# EAGLE design MagSpark (EAGLE 7.1.0)
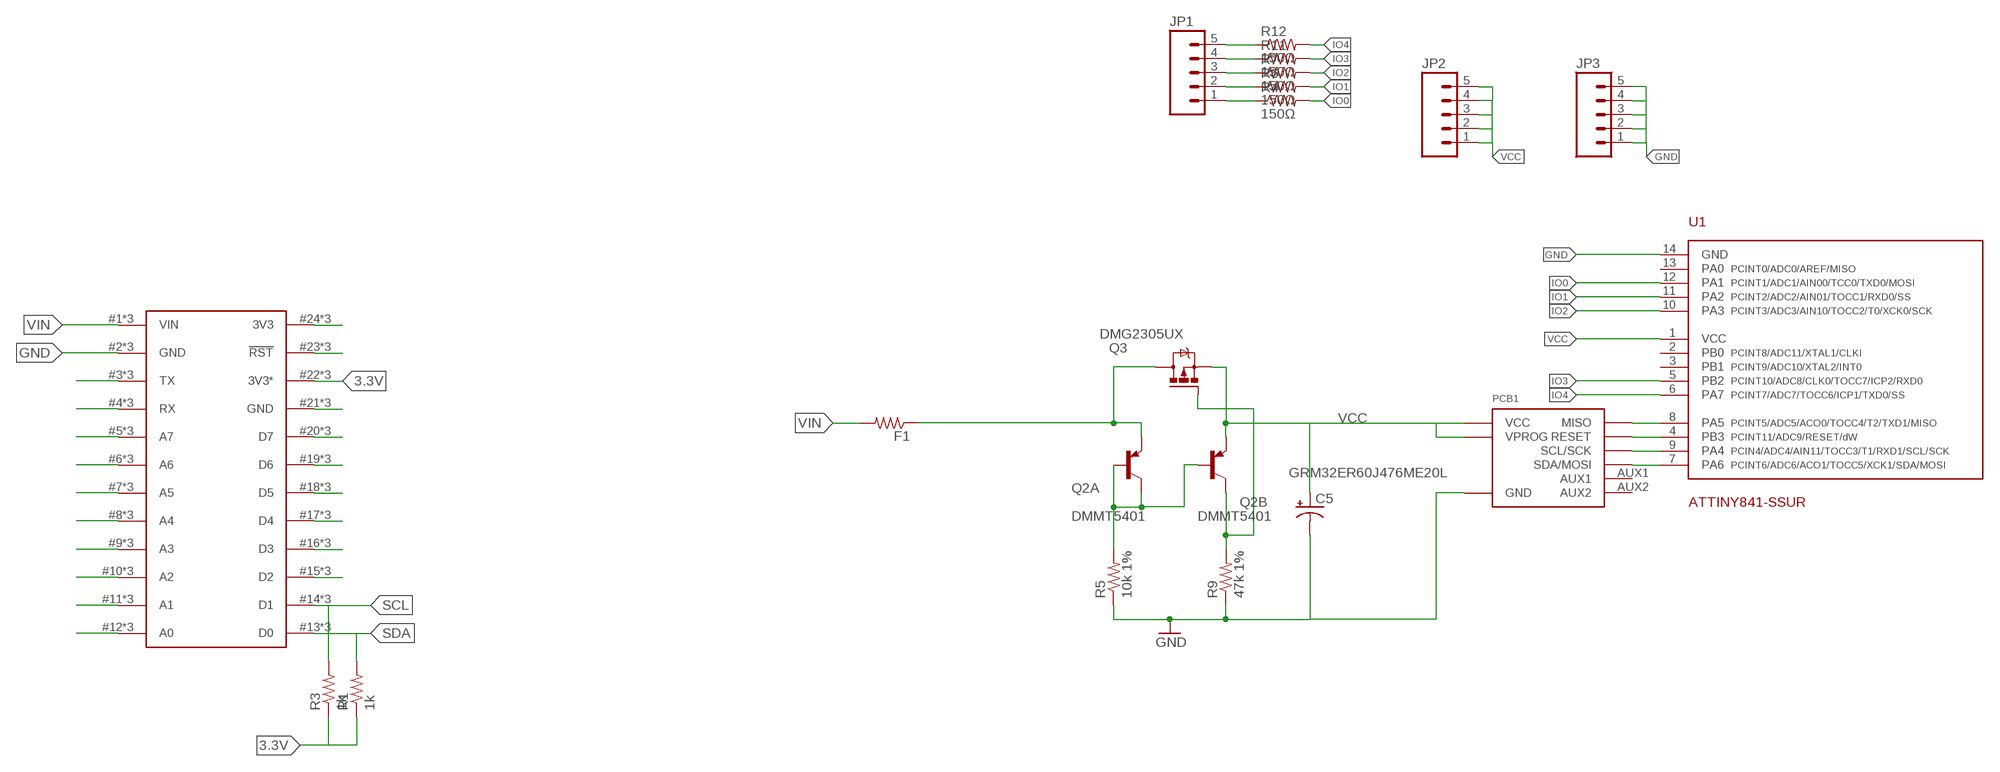
[diagram p0: schematic, sheet 1]

## Parts
C5  CAP_POLC  [PANASONIC_C]
F1  RESISTOR0805-RES  [0805]
JP1  M05NO_SILK  [1X05_NO_SILK]
JP2  M05NO_SILK  [1X05_NO_SILK]
JP3  M05NO_SILK  [1X05_NO_SILK]
PCB1  MAGDEVICE-V2-DOUBLE  [MAGDEVICE-V2-DOUBLE]
Q2  DMMT5401  TRANSISTOR-DUAL-PNP  [SOT-26]
Q3  DMG2305UX  IRLML5203  [MICRO3]
R1  1k  RESISTOR0805-RES  [0805]
R3  1k  RESISTOR0805-RES  [0805]
R4  150Ω  RESISTOR-150Ω  [0603]
R5  10k 1%  RESISTOR0805-RES  [0805]
R6  150Ω  RESISTOR-150Ω  [0603]
R7  150Ω  RESISTOR-150Ω  [0603]
R9  47k 1%  RESISTOR0805-RES  [0805]
R11  150Ω  RESISTOR-150Ω  [0603]
R12  150Ω  RESISTOR-150Ω  [0603]
U1  ATTINY841-SSUR  ATTINY841  [SOIC-14]
U$2  SPARK_CORE  [SPARK_CORE_STACKABLE]

## Nets
3.3V: R1.1 R3.1 U$2.22(3V3*) U$2.#22(3V3*) U$2.@22(3V3*)
GND: C5.- JP3.1 JP3.2 JP3.3 JP3.4 JP3.5 PCB1.GND R5.1 R9.1 U1.14(GND) U$2.2(GND) U$2.#2(GND) U$2.@2(GND)
IO0: R4.2 U1.12(PA1)
IO1: R6.2 U1.11(PA2)
IO2: R7.2 U1.10(PA3)
IO3: R11.2 U1.5(PB2)
IO4: R12.2 U1.6(PA7)
N$1: U$2.3(TX) U$2.#3(TX) U$2.@3(TX)
N$2: U$2.4(RX) U$2.#4(RX) U$2.@4(RX)
N$3: U$2.5(A7) U$2.#5(A7) U$2.@5(A7)
N$4: U$2.6(A6) U$2.#6(A6) U$2.@6(A6)
N$5: U$2.7(A5) U$2.#7(A5) U$2.@7(A5)
N$6: U$2.8(A4) U$2.#8(A4) U$2.@8(A4)
N$7: U$2.9(A3) U$2.#9(A3) U$2.@9(A3)
N$8: U$2.10(A2) U$2.#10(A2) U$2.@10(A2)
N$9: U$2.11(A1) U$2.#11(A1) U$2.@11(A1)
N$10: U$2.12(A0) U$2.#12(A0) U$2.@12(A0)
N$11: U$2.24(3V3) U$2.#24(3V3) U$2.@24(3V3)
N$12: U$2.23(!RST) U$2.#23(!RST) U$2.@23(!RST)
N$13: U$2.21(GND) U$2.#21(GND) U$2.@21(GND)
N$14: Q2.1(A:C) Q2.2(A:B) Q2.3(B:B) R5.2
N$15: U$2.20(D7) U$2.#20(D7) U$2.@20(D7)
N$16: Q2.4(B:C) Q3.1(G) R9.2
N$17: U$2.19(D6) U$2.#19(D6) U$2.@19(D6)
N$18: U$2.18(D5) U$2.#18(D5) U$2.@18(D5)
N$19: U$2.17(D4) U$2.#17(D4) U$2.@17(D4)
N$20: U$2.16(D3) U$2.#16(D3) U$2.@16(D3)
N$21: U$2.15(D2) U$2.#15(D2) U$2.@15(D2)
N$22: PCB1.MISO U1.8(PA5)
N$23: PCB1.RESET U1.4(PB3)
N$24: PCB1.SCL(SCL/SCK) U1.9(PA4)
N$25: PCB1.SDA(SDA/MOSI) U1.7(PA6)
N$26: JP1.1 R4.1
N$27: JP1.2 R6.1
N$28: JP1.3 R7.1
N$29: JP1.4 R11.1
N$30: JP1.5 R12.1
SCL: R3.2 U$2.14(D1) U$2.#14(D1) U$2.@14(D1)
SDA: R1.2 U$2.13(D0) U$2.#13(D0) U$2.@13(D0)
VCC: C5.+ JP2.1 JP2.2 JP2.3 JP2.4 JP2.5 PCB1.VCC PCB1.VPROG Q2.5(B:E) Q3.2(S) U1.1(VCC)
VIN: F1.2 U$2.1(VIN) U$2.#1(VIN) U$2.@1(VIN)
VREG: F1.1 Q2.6(A:E) Q3.3(D)
Unconnected: PCB1.AUX1 PCB1.AUX2 U1.2(PB0) U1.3(PB1) U1.13(PA0)

## Notes on the sheet
- GRM32ER60J476ME20L

## Library data of the parts
C5 = IntegerLabs:CAP_POL: Capacitor Polarized These are standard SMD and PTH capacitors. Normally 10uF, 47uF, and 100uF in electrolytic and tantalum varieties. Always verify the external diameter of the through hole cap, it varies with capacity, voltage, and manufacturer. The EIA devices should be standard.
F1 R1 R3 R5 R9 = SparkFun-Passives:RESISTOR: Resistor Basic schematic elements and footprints for 0603, 1206, and PTH resistors.
JP1-JP3 = SparkFun-Connectors:M05: Header 5 Standard 5-pin 0.1" header. Use with straight break away headers (SKU : PRT-00116), right angle break away headers (PRT-00553), swiss pins (PRT-00743), machine pins (PRT-00117), and female headers (PRT-00115). Molex polarized connector foot print use with SKU : PRT-08230 with associated crimp pins and housings.
PCB1 = Modulo:MAGDEVICE
Q2 = IntegerLabs:TRANSISTOR-DUAL-PNP: PNP Transistor
Q3 = transistor-power:IRLML5203: HEXFET P-Channel Power MOSFET
R4 R6 R7 R11 R12 = Modulo:RESISTOR: Resistor Basic schematic elements and footprints for 0603, 1206, and PTH resistors.; PARTNUM: ERJ-3EKF1500V
U1 = Modulo:ATTINY841
U$2 = Spark:SPARK_CORE

## Board
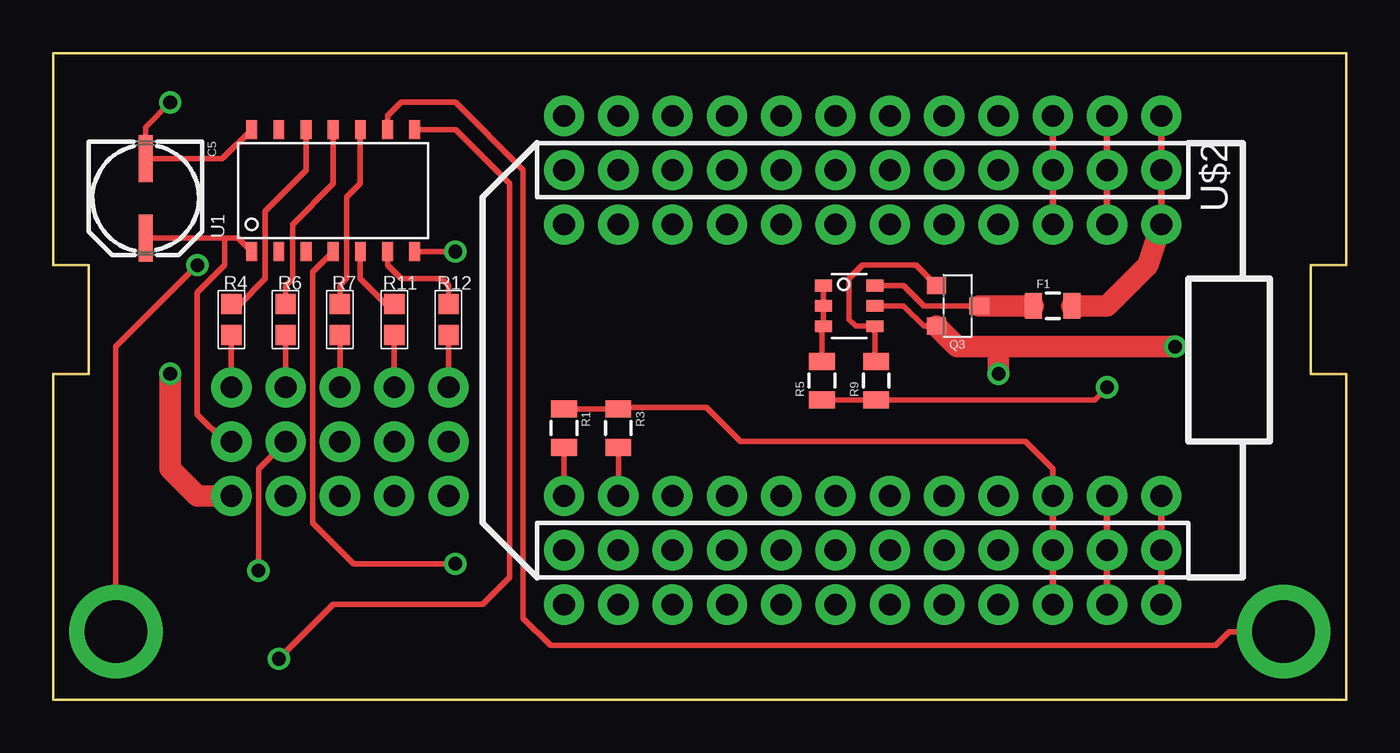
[diagram p1: board, top side]
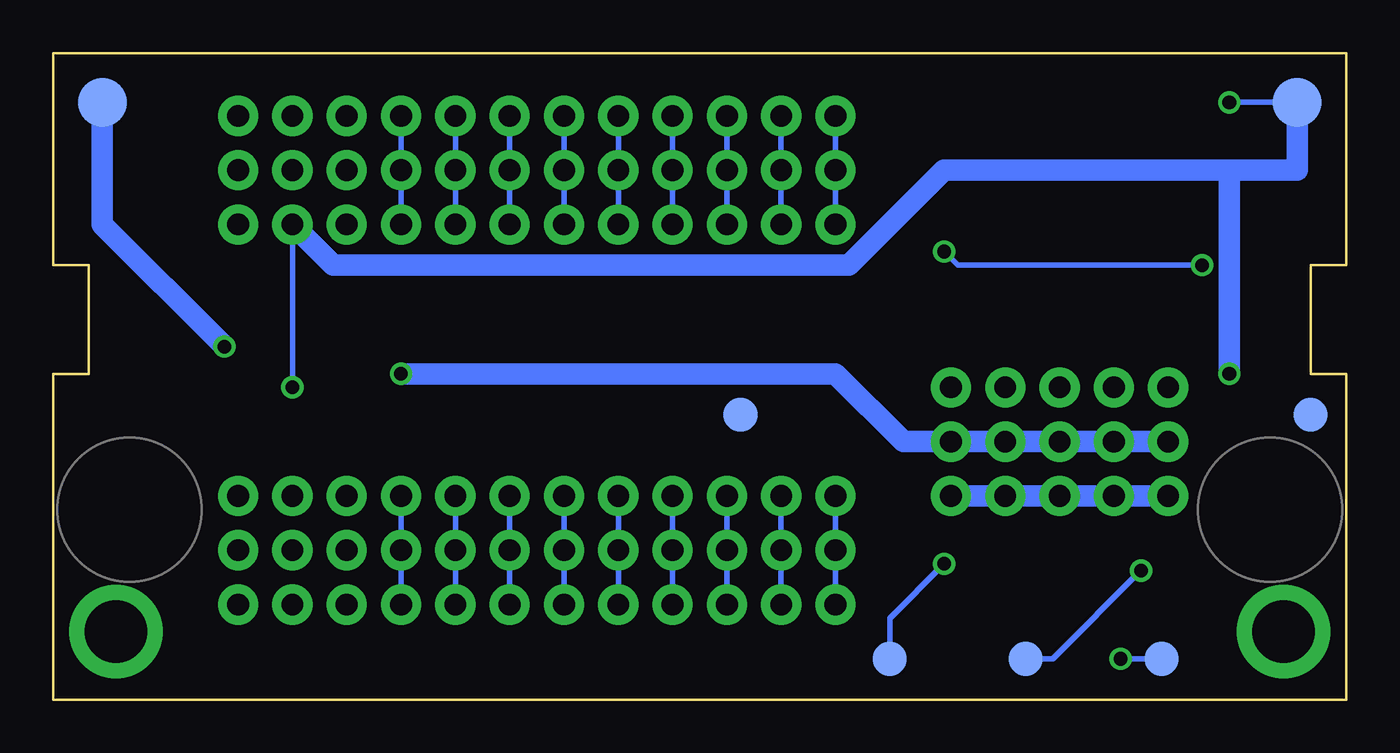
[diagram p2: board, bottom side, seen from below]

Size 60.45 x 30.23 mm. Coordinates in mm from the lower left corner, seen from the top.
Copper layers (1*16): Top 0.0178mm / dielectric 59mil / Bottom 0.0178mm
Design rules "SSC-EAGLE-2Lyr_v1.0.0.3": minimum track width 6mil, minimum drill 14mil, track to track 6mil, track to pad 6mil, pad to pad 6mil, via to via 6mil, smd to smd 6mil, copper to edge 20mil, drill to drill 16mil, minimum pad ring 8mil, minimum via ring 8mil, stop-mask expansion 3mil, vias tented up to drill 0mil, thermal gap 10mil

### Footprints (pad centres in the part's own frame; a part is rotated, then mirrored left to right if it is on the bottom)
PANASONIC_C = smd 2.2 x 0.65: + 1.9,-0.2; - -1.8,-0.2
0805 = smd 0.8 x 1.2: 1 -0.9,0; 2 0.9,0
1X05_NO_SILK = drill 1.016 pad 1.88: 1 0,0; 2 2.54,0; 3 5.08,0; 4 7.62,0; 5 10.16,0
MAGDEVICE-V2-DOUBLE = smd 1.587 x 1.587 bottom: AUX1 1.905,13.335; AUX2 28.575,13.335; MISO 8.89,1.905; RESET 21.59,1.905; VPROG 15.24,1.905 | smd 2.286 x 2.286 bottom: GND 2.54,27.94; VCC 58.42,27.94 | drill 2.921: SCL 57.785,3.175; SDA 3.175,3.175
SOT-26 = smd 0.55 x 0.8: 1 -0.95,-1.2; 2 0,-1.2; 3 0.95,-1.2; 4 0.95,1.2; 5 0,1.2; 6 -0.95,1.2
MICRO3 = smd 0.8 x 0.9: 1 -0.95,-1; 2 0.95,-1; 3 0,1
0603 = smd 0.95 x 0.95: 1 -0.725,0; 2 0.725,0
SOIC-14 = smd 0.508 x 0.889: 1 0,-3.175; 2 1.27,-3.175; 3 2.54,-3.175; 4 3.81,-3.175; 5 5.08,-3.175; 6 6.35,-3.175; 7 7.62,-3.175; 8 7.62,2.54; 9 6.35,2.54; 10 5.08,2.54; 11 3.81,2.54; 12 2.54,2.54; 13 1.27,2.54; 14 0,2.54
SPARK_CORE_STACKABLE = drill 1.016 pad 1.88: 1 -8.89,13.97; 2 -8.89,11.43; 3 -8.89,8.89; 4 -8.89,6.35; 5 -8.89,3.81; 6 -8.89,1.27; 7 -8.89,-1.27; 8 -8.89,-3.81; 9 -8.89,-6.35; 10 -8.89,-8.89; 11 -8.89,-11.43; 12 -8.89,-13.97; 13 8.89,-13.97; 14 8.89,-11.43; 15 8.89,-8.89; 16 8.89,-6.35; 17 8.89,-3.81; 18 8.89,-1.27; 19 8.89,1.27; 20 8.89,3.81; 21 8.89,6.35; 22 8.89,8.89; 23 8.89,11.43; 24 8.89,13.97; #1 -6.35,13.97; #2 -6.35,11.43; #3 -6.35,8.89; #4 -6.35,6.35; #5 -6.35,3.81; #6 -6.35,1.27; #7 -6.35,-1.27; #8 -6.35,-3.81; #9 -6.35,-6.35; #10 -6.35,-8.89; #11 -6.35,-11.43; #12 -6.35,-13.97; #13 11.43,-13.97; #14 11.43,-11.43; #15 11.43,-8.89; #16 11.43,-6.35; #17 11.43,-3.81; #18 11.43,-1.27; #19 11.43,1.27; #20 11.43,3.81; #21 11.43,6.35; #22 11.43,8.89; #23 11.43,11.43; #24 11.43,13.97; @1 -11.43,13.97; @2 -11.43,11.43; @3 -11.43,8.89; @4 -11.43,6.35; @5 -11.43,3.81; @6 -11.43,1.27; @7 -11.43,-1.27; @8 -11.43,-3.81; @9 -11.43,-6.35; @10 -11.43,-8.89; @11 -11.43,-11.43; @12 -11.43,-13.97; @13 6.35,-13.97; @14 6.35,-11.43; @15 6.35,-8.89; @16 6.35,-6.35; @17 6.35,-3.81; @18 6.35,-1.27; @19 6.35,1.27; @20 6.35,3.81; @21 6.35,6.35; @22 6.35,8.89; @23 6.35,11.43; @24 6.35,13.97

### Placement (x,y rotation side)
C5  4.51,23.5 270 top
F1  46.74,18.41 0 top
JP1  8.32,14.61 0 top
JP2  8.32,12.06 0 top
JP3  8.32,9.53 0 top
PCB1  -0.25,0 0 top
Q2  37.21,18.41 270 top
Q3  42.29,18.41 270 top
R1  23.88,12.7 270 top
R3  26.42,12.7 270 top
R4  8.32,17.78 90 top
R5  35.94,14.92 90 top
R6  10.86,17.78 90 top
R7  13.4,17.78 90 top
R9  38.48,14.92 90 top
R11  15.94,17.78 90 top
R12  18.48,17.78 90 top
U1  9.27,24.13 0 top
U$2  37.85,15.88 270 top

### Tracks (layer width: path | path; a pad name or v marks a point on that pad's centre or on a via)
3.3V
  Top 0.254: U$2.@22 46.74,10.79 45.47,12.06 32.13,12.06 30.54,13.65 26.47,13.65 R3.1 R1.1
  Top 0.305: U$2.#22 U$2.22 U$2.@22
GND  (via drill 0.64)
  Top 0.254: U1.14 7.9,25.3 C5.- 4.31,26.79 v5.46,27.94 | R5.1 R9.1 48.69,14.02 v49.28,14.61
  Top 0.305: U$2.@2 U$2.2 U$2.#2
  Top 1.016: v5.46,15.24 5.46,10.79 6.73,9.53 JP3.1
  Bottom 0.254: PCB1.GND v5.46,27.94 | v49.28,14.61 U$2.#2
  Bottom 1.016: JP3.5 JP3.4 JP3.3 JP3.2 JP3.1 | PCB1.GND 2.29,24.77 5.46,24.77 | U$2.#2 47.37,20.32 23.24,20.32 18.8,24.77 5.46,24.77 | v5.46,15.24 5.46,24.77
IO0
  Top 0.254: R4.2 8.73,18.5 9.91,19.68 9.91,22.86 11.81,24.77 U1.12
IO1
  Top 0.254: R6.2 10.86,19.37 11.18,19.68 11.18,22.23 13.08,24.13 U1.11
IO2
  Top 0.254: R7.2 13.4,19.37 13.72,19.68 13.72,23.5 14.35,24.13 U1.10
IO3
  Top 0.254: R11.2 15.53,18.5 14.35,19.68 U1.5
IO4
  Top 0.254: R12.2 18.48,19.37 18.16,19.68 16.26,19.68 15.62,20.32 U1.6
N$1
  Top 0.305: U$2.@3 U$2.3 U$2.#3
N$2
  Bottom 0.254: U$2.#4 U$2.4 U$2.@4
N$3
  Bottom 0.254: U$2.@5 U$2.5 U$2.#5
N$4
  Bottom 0.254: U$2.#6 U$2.6 U$2.@6
N$5
  Bottom 0.254: U$2.@7 U$2.7 U$2.#7
N$6
  Bottom 0.254: U$2.@8 U$2.8 U$2.#8
N$7
  Bottom 0.254: U$2.@9 U$2.9 U$2.#9
N$8
  Bottom 0.254: U$2.@10 U$2.10 U$2.#10
N$9
  Bottom 0.254: U$2.#11 U$2.11 U$2.@11
N$10
  Bottom 0.254: U$2.@12 U$2.12 U$2.#12
N$11
  Top 0.305: U$2.#24 U$2.24 U$2.@24
N$12
  Top 0.305: U$2.#23 U$2.23 U$2.@23
N$13
  Bottom 0.254: U$2.@21 U$2.21 U$2.#21
N$14
  Top 0.254: R5.2 35.94,17.39 Q2.3 Q2.2 Q2.1
N$15
  Bottom 0.254: U$2.#20 U$2.20 U$2.@20
N$16
  Top 0.254: R9.2 38.41,15.89 Q2.4 37.53,17.46 37.21,17.78 37.21,19.68 37.85,20.32 40.34,20.32 Q3.1
N$17
  Bottom 0.254: U$2.@19 U$2.19 U$2.#19
N$18
  Bottom 0.254: U$2.#18 U$2.18 U$2.@18
N$19
  Bottom 0.254: U$2.@17 U$2.17 U$2.#17
N$20
  Bottom 0.254: U$2.#16 U$2.16 U$2.@16
N$21
  Bottom 0.254: U$2.@15 U$2.15 U$2.#15
N$22  (via drill 0.64)
  Top 0.254: U1.8 18.8,26.67 21.34,24.13 21.34,5.71 20.07,4.45 13.08,4.45 v10.54,1.91
  Bottom 0.254: PCB1.MISO v10.54,1.91
N$23  (via drill 0.64)
  Top 0.254: v18.8,6.35 14.03,6.35 12.13,8.26 12.13,20 U1.4
  Bottom 0.254: PCB1.RESET 21.34,3.81 v18.8,6.35
N$24
  Top 0.254: PCB1.SCL 54.99,3.17 54.36,2.54 23.24,2.54 21.97,3.81 21.97,24.77 18.8,27.94 16.26,27.94 15.62,27.3 U1.9
N$25  (via drill 0.64)
  Top 0.254: PCB1.SDA 2.92,16.51 v6.73,20.32 | U1.7 v18.8,20.95
  Bottom 0.254: v6.73,20.32 18.16,20.32 v18.8,20.95
N$26
  Top 0.254: R4.1 JP1.1
N$27
  Top 0.254: R6.1 JP1.2
N$28
  Top 0.254: R7.1 JP1.3
N$29
  Top 0.254: R11.1 JP1.4
N$30
  Top 0.254: R12.1 JP1.5
SCL
  Top 0.254: R3.2 U$2.@14
  Bottom 0.254: U$2.#14 U$2.14 U$2.@14
SDA
  Top 0.254: R1.2 U$2.@13
  Bottom 0.254: U$2.@13 U$2.13 U$2.#13
VCC  (via drill 0.64)
  Top 0.254: C5.+ 8,21.59 | 8,21.59 8.63,21.59 U1.1 | Q2.5 39.75,18.41 40.7,17.46 Q3.2 | 8,21.59 8,20.32 6.73,19.05 6.73,13.34 8,12.06 JP2.1 | v9.59,6.03 9.59,10.79 JP2.2
  Top 1.016: v52.45,16.51 44.2,16.51 | 44.2,16.51 42.25,16.51 Q3.2 | 44.2,16.51 v44.2,15.24
  Bottom 0.254: PCB1.VPROG 13.72,1.91 v9.59,6.03
  Bottom 1.016: PCB1.VCC 58.17,22.23 v52.45,16.51 | v44.2,15.24 23.88,15.24 20.7,12.06 JP2.5 JP2.4 JP2.3 JP2.2 JP2.1
VIN
  Top 0.305: U$2.@1 U$2.1 U$2.#1
  Top 1.016: F1.2 49.28,18.41 51.18,20.32 U$2.#1
VREG
  Top 0.254: Q2.6 39.75,19.36 40.7,18.41 Q3.3
  Top 1.016: F1.1 Q3.3